# EasyEDA schematic EasyEDAProject.json
TITLE: ESP Cloud Remote; REV: 0.1; Date: 12-10-2024; Sheet: 1/1
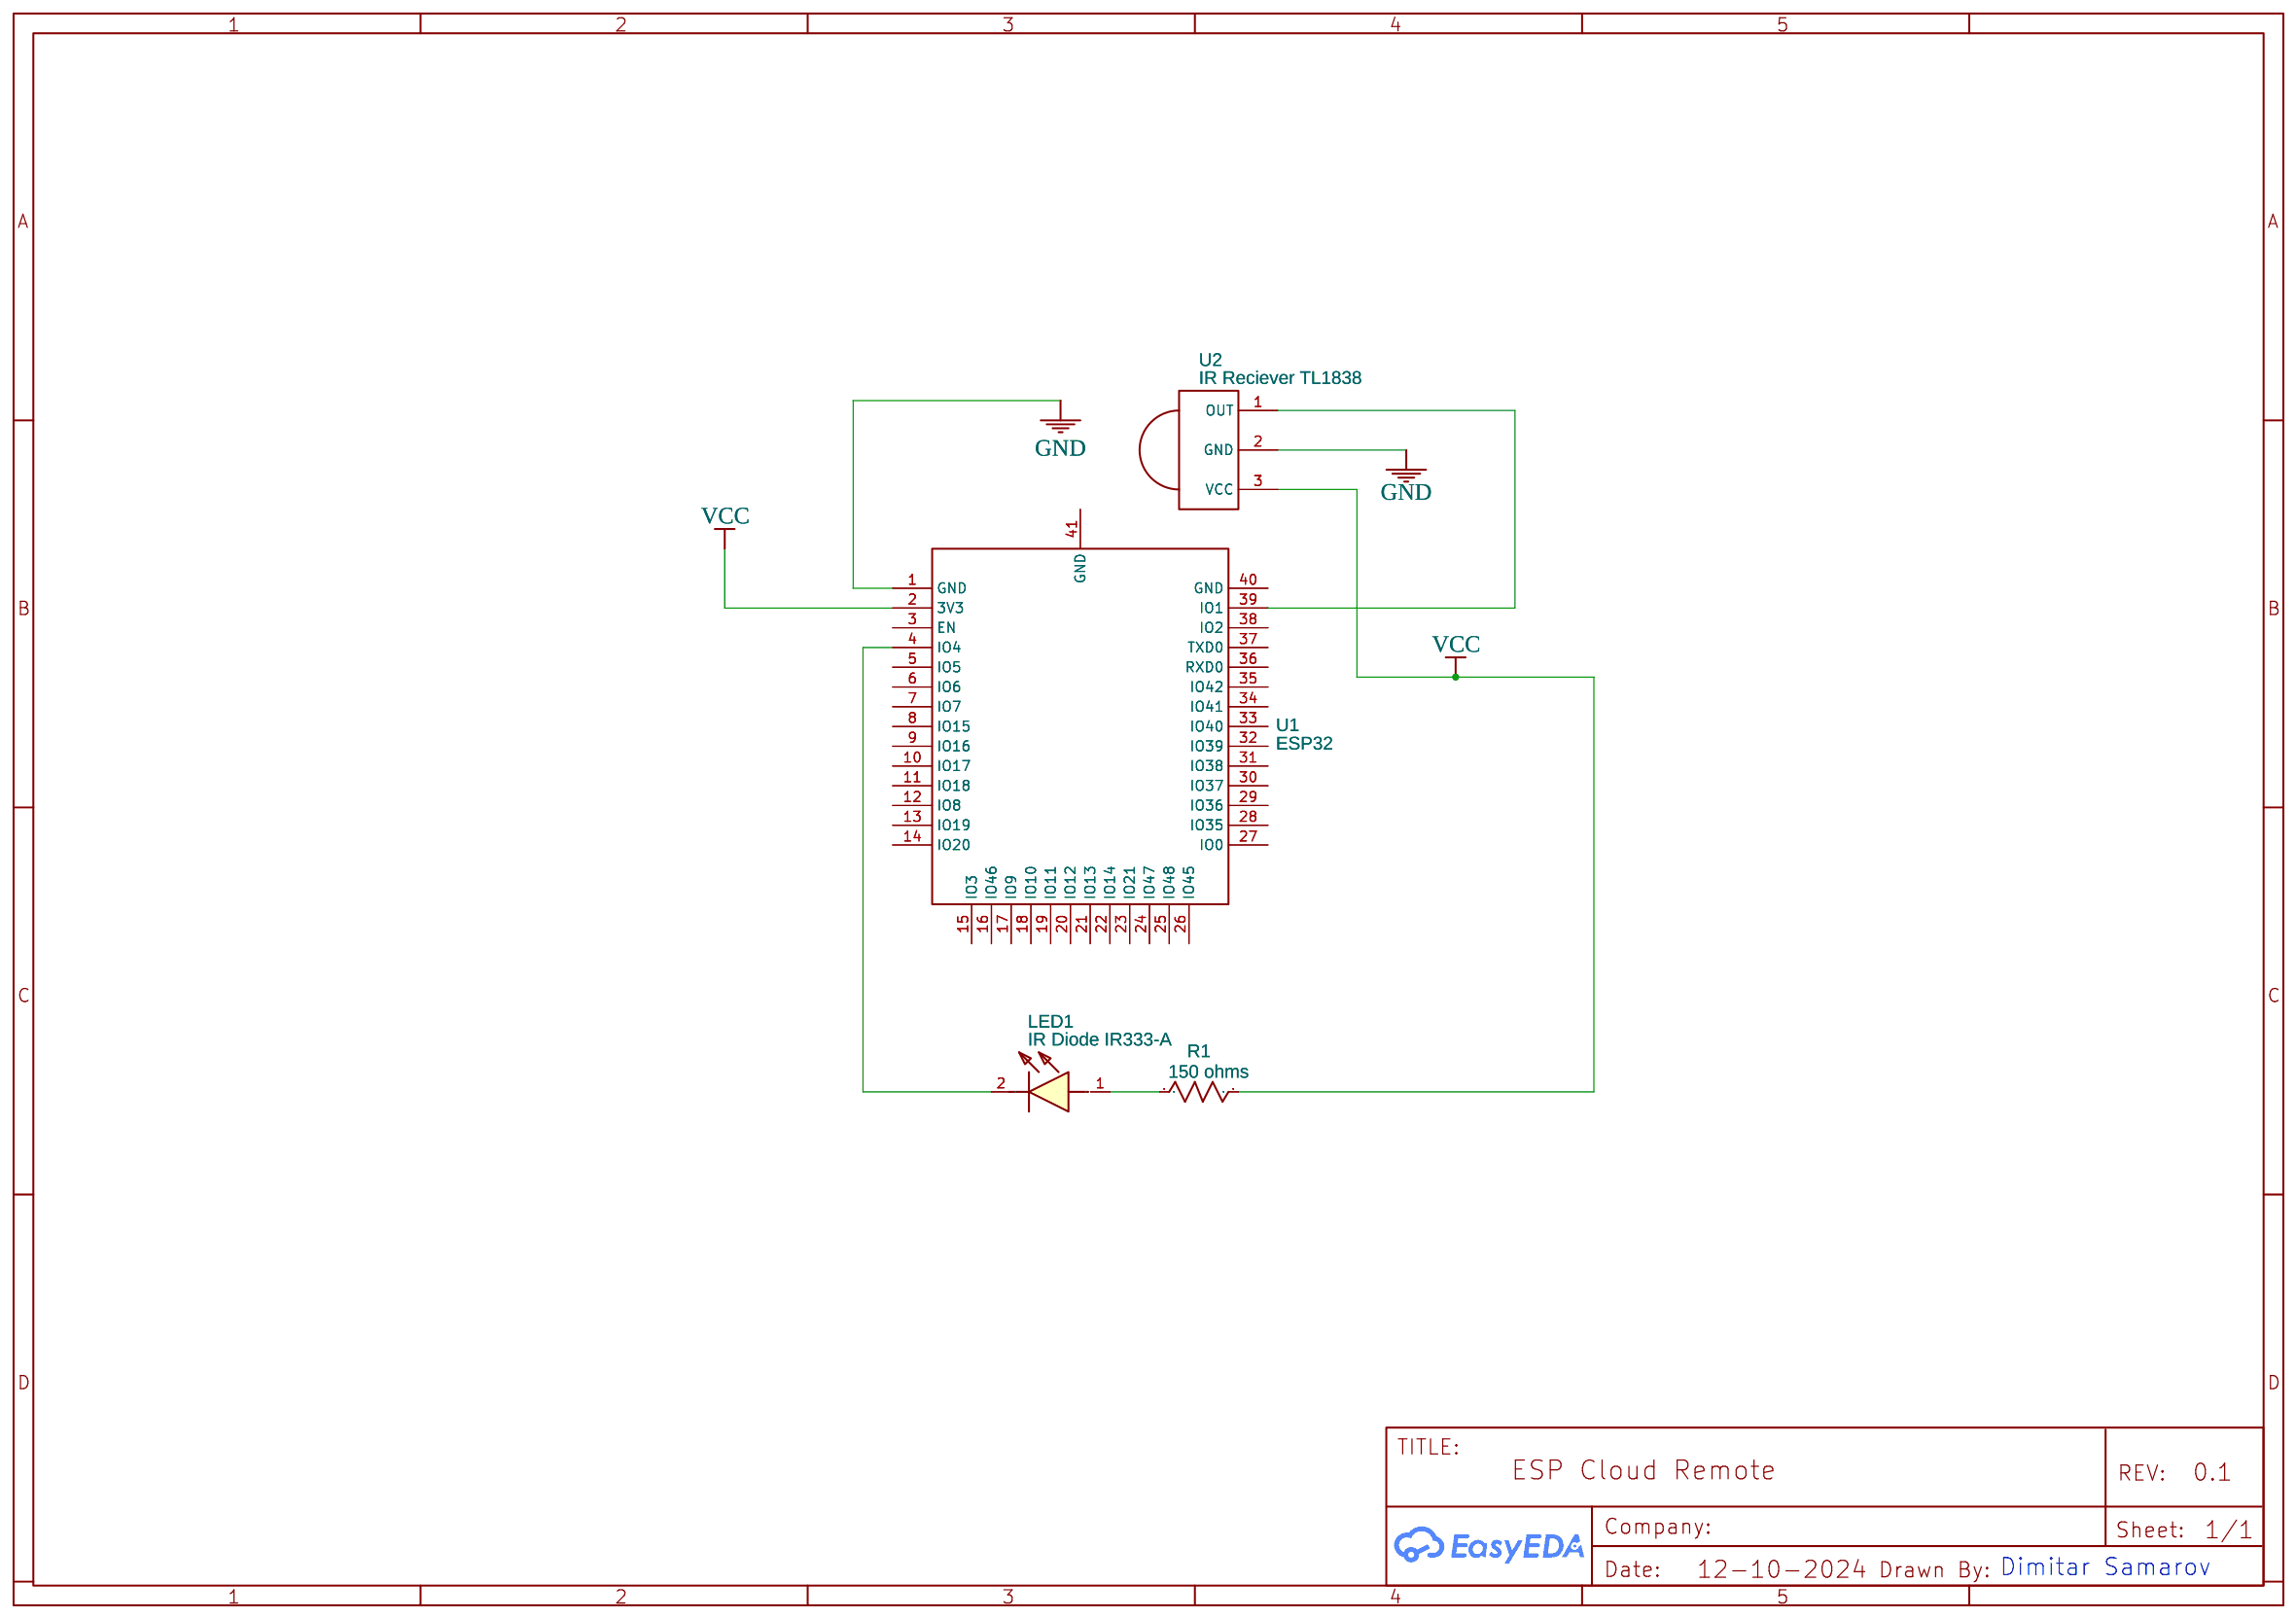
[diagram p0: schematic sheet]

## Parts
LED1  IR Diode IR333-A  [IR333A]
R1  150 ohms  [R0603]
U1  ESP32  [WIRELM-SMD_ESP32-S3-WROOM-1U]
U2  IR Reciever TL1838  [TL1838]

## Library data of the parts
LED1 = IR333-A: Contributor: maitripatel0410
R1 = R_0603_US: Contributor: LCEDA_Lib
U1 = ESP32-S3-WROOM-1U-N4: Contributor: LCSC; Supplier: LCSC; Supplier Part: C2980296; Manufacturer: ESPRESSIF(乐鑫); JLCPCB Part Class: Extended Part
U2 = TL1838: Contributor: karelgomez124

## Nets
GND: U1.1(GND) U2.2(GND)
VCC: R1.2 U1.2(3V3) U2.3(VCC)
Net-(LED1-1): LED1.1(A) R1.1
Net-(LED1-2): LED1.2(K) U1.4(IO4)
Net-(U1-39): U1.39(IO1) U2.1(OUT)

Not connected (* = marked no-connect by the designer): U1 3(EN) 5(IO5) 6(IO6) 7(IO7) 8(IO15) 9(IO16) 10(IO17) 11(IO18) 12(IO8) 13(IO19) 14(IO20) 15(IO3) 16(IO46) 17(IO9) 18(IO10) 19(IO11) 20(IO12) 21(IO13) 22(IO14) 23(IO21) 24(IO47) 25(IO48) 26(IO45) 27(IO0) 28(IO35) 29(IO36) 30(IO37) 31(IO38) 32(IO39) 33(IO40) 34(IO41) 35(IO42) 36(RXD0) 37(TXD0) 38(IO2) 40(GND) 41(GND)

## Notes on the sheet
- Dimitar Samarov
